# EAGLE design schematic (EAGLE 9.3.2)
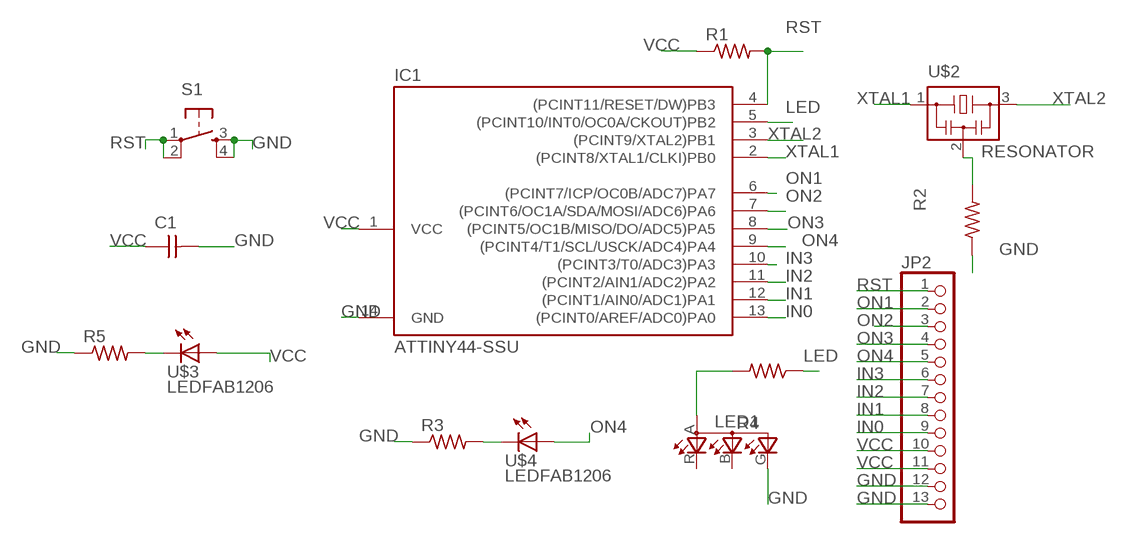
[diagram p0: schematic, sheet 1]

## Parts
C1  CAP-UNPOLARIZEDFAB  [C1206FAB]
IC1  ATTINY44-SSU  [SOIC14]
JP2  PINHD-1X131X13_SMT  [1X13_SMT]
LED1  LEDRGBOLD  [P-LCC-4-3]
R1  RES-US1206FAB  [R1206FAB]
R2  RES-US1206FAB  [R1206FAB]
R3  RES-US1206FAB  [R1206FAB]
R4  RES-US1206FAB  [R1206FAB]
R5  RES-US1206FAB  [R1206FAB]
S1  6MM_SWITCH6MM_SWITCH  [6MM_SWITCH]
U$2  RESONATOR  [EFOBM]
U$3  LEDFAB1206  [LED1206FAB]
U$4  LEDFAB1206  [LED1206FAB]

## Nets
GND: C1.2 IC1.14(GND) JP2.12 JP2.13 LED1.G(CGREEN) R2.1 R3.1 R5.1 S1.3(S) S1.4(S1)
IN0: IC1.13((PCINT0/AREF/ADC0)PA0) JP2.9
IN1: IC1.12((PCINT1/AIN0/ADC1)PA1) JP2.8
IN2: IC1.11((PCINT2/AIN1/ADC2)PA2) JP2.7
IN3: IC1.10((PCINT3/T0/ADC3)PA3) JP2.6
LED: IC1.5((PCINT10/INT0/OC0A/CKOUT)PB2) R4.1
N$1: R2.2 U$2.2
N$2: R5.2 U$3.2(C)
N$3: R3.2 U$4.2(C)
N$4: LED1.A(A2) R4.2
ON1: IC1.6((PCINT7/ICP/OC0B/ADC7)PA7) JP2.2
ON2: IC1.7((PCINT6/OC1A/SDA/MOSI/ADC6)PA6) JP2.3
ON3: IC1.8((PCINT5/OC1B/MISO/DO/ADC5)PA5) JP2.4
ON4: IC1.9((PCINT4/T1/SCL/USCK/ADC4)PA4) JP2.5 U$4.1(A)
RST: IC1.4((PCINT11/RESET/DW)PB3) JP2.1 R1.2 S1.1(P) S1.2(P1)
VCC: C1.1 IC1.1(VCC) JP2.10 JP2.11 R1.1 U$3.1(A)
XTAL1: IC1.2((PCINT8/XTAL1/CLKI)PB0) U$2.1
XTAL2: IC1.3((PCINT9/XTAL2)PB1) U$2.3
Unconnected: LED1.B(CBLUE) LED1.R(CRED)

## Library data of the parts
C1 = fab:CAP-UNPOLARIZED
IC1 = fab:ATTINY44
JP2 = smd_con:PINHD-1X13: PIN HEADER
LED1 = fab:LEDRGBOLD: OSRAM Hyper Multi TOPLED® Hyper-Bright LED LATB T686 Source: http://www.osram.convergy.de/
R1-R5 = fab:RES-US: Resistor (US Symbol) Variants with postfix FAB are widened to allow the routing of internal traces
S1 = fab:6MM_SWITCH: OMRON SWITCH
U$2 = fab:RESONATOR
U$3 U$4 = fab:LED: LED

## Board
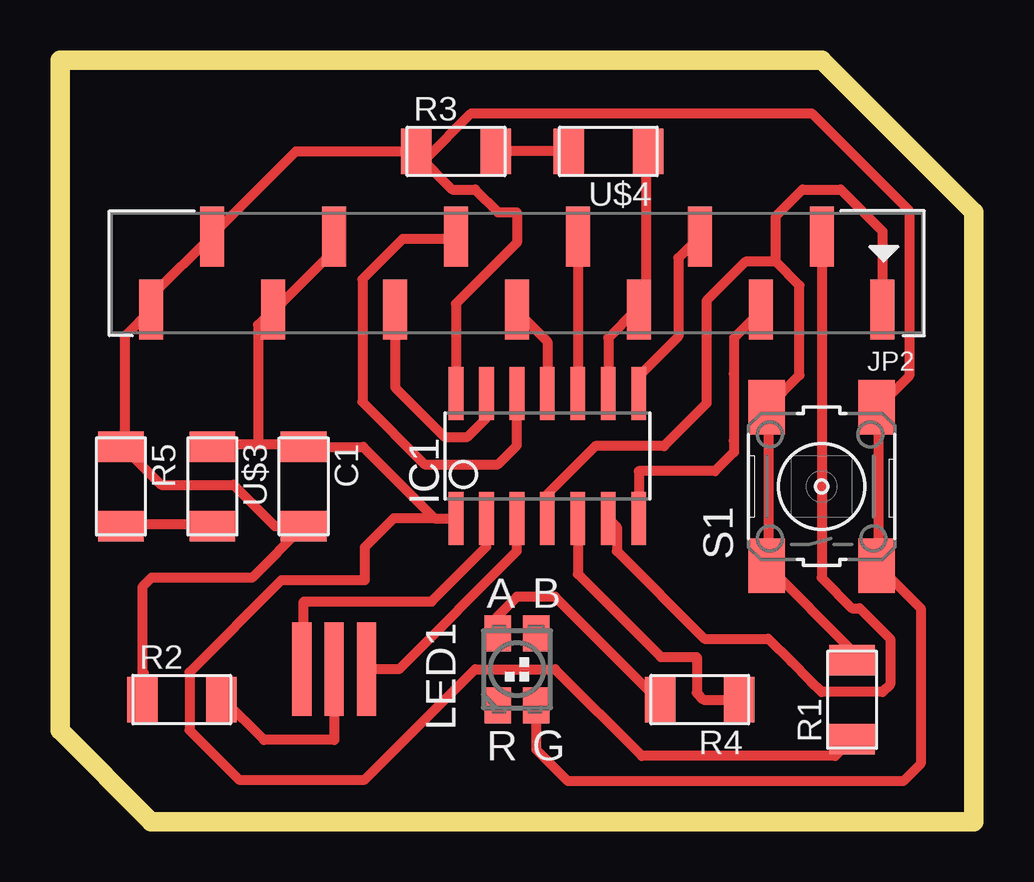
[diagram p1: board, top side]

Size 38.1 x 31.75 mm. Coordinates in mm from the lower left corner, seen from the top.
Outline: 31.75,31.75 0,31.75 0,3.81 3.81,0 38.1,0 38.1,25.4 31.75,31.75
Copper layers (1*16): Top 0.035mm / dielectric 1.5mm / Bottom 0.035mm
Design rules "default *": minimum track width 16mil, minimum drill 0.35mm, track to track 8mil, track to pad 16mil, pad to pad 16mil, via to via 16mil, smd to smd 16mil, copper to edge 40mil, drill to drill 6mil, minimum pad ring 10mil, minimum via ring 8mil, stop-mask expansion 4mil, vias tented up to drill 0mil, thermal gap 10mil

### Footprints (pad centres in the part's own frame; a part is rotated, then mirrored left to right if it is on the bottom)
C1206FAB = smd 1.27 x 1.905: 1 -1.651,0; 2 1.651,0
SOIC14 = smd 0.61 x 2.21: 1 -3.81,-2.603; 2 -2.54,-2.603; 3 -1.27,-2.603; 4 0,-2.603; 5 1.27,-2.603; 6 2.54,-2.603; 7 3.81,-2.603; 8 3.81,2.603; 9 2.54,2.603; 10 1.27,2.603; 11 0,2.603; 12 -1.27,2.603; 13 -2.54,2.603; 14 -3.81,2.603
1X13_SMT = smd 1 x 2.5: 1 -15.24,1.52; 2 -12.7,-1.52; 3 -10.16,1.52; 4 -7.62,-1.52; 5 -5.08,1.52; 6 -2.54,-1.52; 7 0,1.52; 8 2.54,-1.52; 9 5.08,1.52; 10 7.62,-1.52; 11 10.16,1.52; 12 12.7,-1.52; 13 15.24,1.52
P-LCC-4-3 = smd 1.1 x 1.5: A -0.8,1.5; B 0.8,1.5; G 0.8,-1.5; R -0.8,-1.5
R1206FAB = smd 1.27 x 1.905: 1 -1.651,0; 2 1.651,0
6MM_SWITCH = smd 2.286 x 1.524: 1 -3.302,2.286; 2 3.302,2.286; 3 -3.302,-2.286; 4 3.302,-2.286
EFOBM = smd 0.8 x 3.9: 1 -1.35,0; 2 0,0; 3 1.35,0
LED1206FAB = smd 1.27 x 1.905: 1 -1.651,0; 2 1.651,0

### Placement (x,y rotation side)
C1  10.16,13.97 270 top
IC1  20.32,15.24 0 top
JP2  19.05,22.86 180 top
LED1  19.05,6.35 0 top
R1  33.02,5.08 90 top
R2  5.08,5.08 0 top
R3  16.51,27.94 0 top
R4  26.67,5.08 180 top
R5  2.54,13.97 270 top
S1  31.75,13.97 90 top
U$2  11.43,6.35 0 top
U$3  6.35,13.97 270 top
U$4  22.86,27.94 180 top

### Tracks (layer width: path | path; a pad name or v marks a point on that pad's centre or on a via)
GND
  Top 0.406: LED1.G 19.85,3.01 21.18,1.68 35.15,1.68 35.88,2.41 35.88,8.89 34.13,10.64 S1.3 34.13,10.79 34.13,17.15 S1.4 34.13,17.3 35.4,18.57 35.4,25.46 31.34,29.53 17.14,29.53 15.24,27.62 R3.1 | 3.49,6.19 3.49,5.08 R2.1 3.43,9.78 3.81,10.16 8,10.16 C1.2 | C1.2 9.62,12.32 | R3.1 9.84,27.94 6.35,24.45 JP2.12 6.19,24.29 3.97,22.07 3.97,21.43 JP2.13 2.7,20.23 2.7,15.56 | IC1.14 16.51,21.59 19.05,24.13 19.05,25.4 18.26,25.4 17.3,26.35 16.35,26.35 14.92,27.78 R3.1 | 2.7,15.56 4.22,14.03 7.24,14.03 8.95,12.32 C1.2 | 2.7,15.56 R5.1
IN0
  Top 0.406: IC1.13 17.78,16.83 16.99,16.03 16.03,16.03 13.97,18.1 JP2.9
IN1
  Top 0.406: IC1.12 19.05,15.69 18.26,14.89 15.21,14.89 12.61,17.49 12.61,22.61 14.29,24.29 16.51,24.29 JP2.8
IN2
  Top 0.406: IC1.11 20.32,20 19.05,21.27 JP2.7
IN3
  Top 0.406: JP2.6 IC1.10
LED
  Top 0.406: IC1.5 21.59,10.32 25.05,6.86 26.54,6.86 26.54,5.37 26.83,5.08 R4.1
N$1
  Top 0.406: U$2.2 11.43,3.4 8.51,3.4 6.83,5.08 R2.2
N$2
  Top 0.406: R5.2 2.54,12.38 6.35,12.38 U$3.2
N$3
  Top 0.406: U$4.2 R3.2
N$4
  Top 0.406: LED1.A 18.26,7.94 18.26,8.57 19.05,9.37 20.64,9.37 24.92,5.08 R4.2
ON1
  Top 0.406: JP2.2 31.75,10.16 33.02,8.89 33.34,8.89 34.61,7.62 34.61,5.71 34.29,5.4 31.75,5.4 31.27,5.87 30.48,6.67 29.53,7.62 26.88,7.62 23.22,11.28 23.22,12.28 IC1.6
ON2
  Top 0.406: IC1.7 24.13,14.6 27.3,14.6 28.1,15.4 28.1,15.87 28.09,15.88 28.09,18.67 28.1,18.67 | 28.1,18.67 28.1,18.57 | JP2.3 29.21,21.27 28.1,20.16 28.1,19.05 28.1,18.67
ON3
  Top 0.406: IC1.8 24.13,18.57 25.78,20.23 25.78,23.49 JP2.4
ON4
  Top 0.406: U$4.1 24.45,27.94 24.45,21.75 24.13,21.43 JP2.5 23.97,21.27 22.86,20.16 IC1.9
RST
  Top 0.406: R1.2 33.02,7.14 29.53,10.64 S1.1 29.53,10.79 29.53,17.15 S1.2 29.53,17.3 30.83,18.6 30.83,22.35 29.84,23.34 | IC1.4 20.32,13.65 22.32,15.65 25.18,15.65 26.96,17.43 26.96,21.72 28.57,23.34 29.84,23.34 | JP2.1 34.29,24.61 32.54,26.35 30.96,26.35 29.84,25.24 29.84,23.34
VCC
  Top 0.406: 8.25,15.72 10.16,15.72 C1.1 12.64,15.62 15.62,12.64 | 8.25,15.72 6.35,15.72 U$3.1 | 8.25,15.72 8.25,20.7 JP2.11 9.05,21.43 11.43,23.81 JP2.10 | R1.1 32.32,2.73 24.26,2.73 20.64,6.35 17.3,6.35 12.7,1.75 7.46,1.75 5.4,3.81 5.4,6.22 9.24,10.07 12.7,10.07 12.7,11.43 13.91,12.64 15.62,12.64 | 16.51,12.54 IC1.1 15.62,12.64
XTAL1
  Top 0.406: IC1.2 17.78,11.46 15.49,9.18 10.16,9.18 10.16,6.35 U$2.1
XTAL2
  Top 0.406: IC1.3 19.05,11.27 14.13,6.35 U$2.3